# Altium schematic sheet Connectors_SPI Programer.SchDoc
size 38 x 25 mm
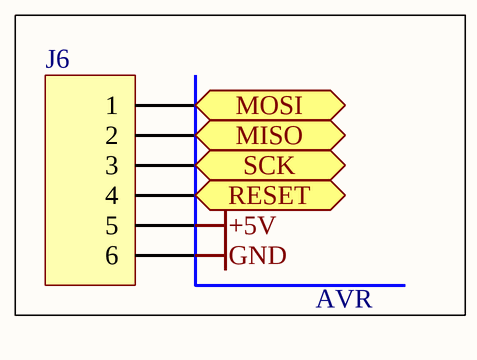
[diagram p0: Connectors_SPI Programer.SchDoc]

## Parts
J6  6PIN  [HDR1X6]  (value not drawn)

## Ports
MISO, MOSI, RESET, SCK

## Nets
+5V: J6.5
GND: J6.6
MISO: J6.2 ; port MISO
MOSI: J6.1 ; port MOSI
RESET: J6.4 ; port RESET
SCK: J6.3 ; port SCK

## Notes on the sheet
- AVR

## Library data of the parts
J6 = Header 6: Header, 6-Pin; LatestRevisionDate: 17-Jul-2002; LatestRevisionNote: Re-released for DXP Platform.; Publisher: Altium Limited